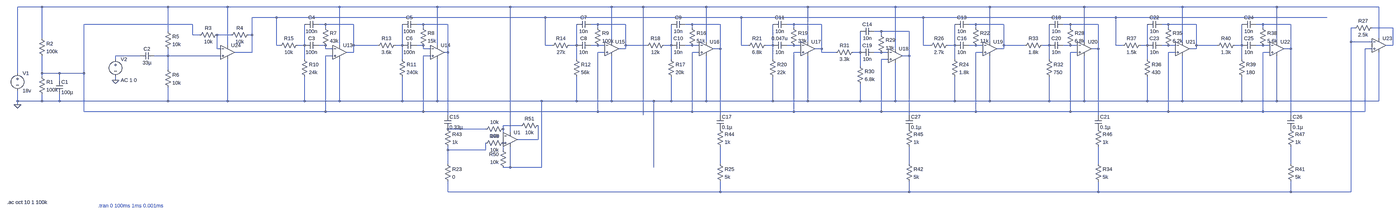
[diagram p0: schematic Final_Advanced_Equilizer.asc, whole sheet]
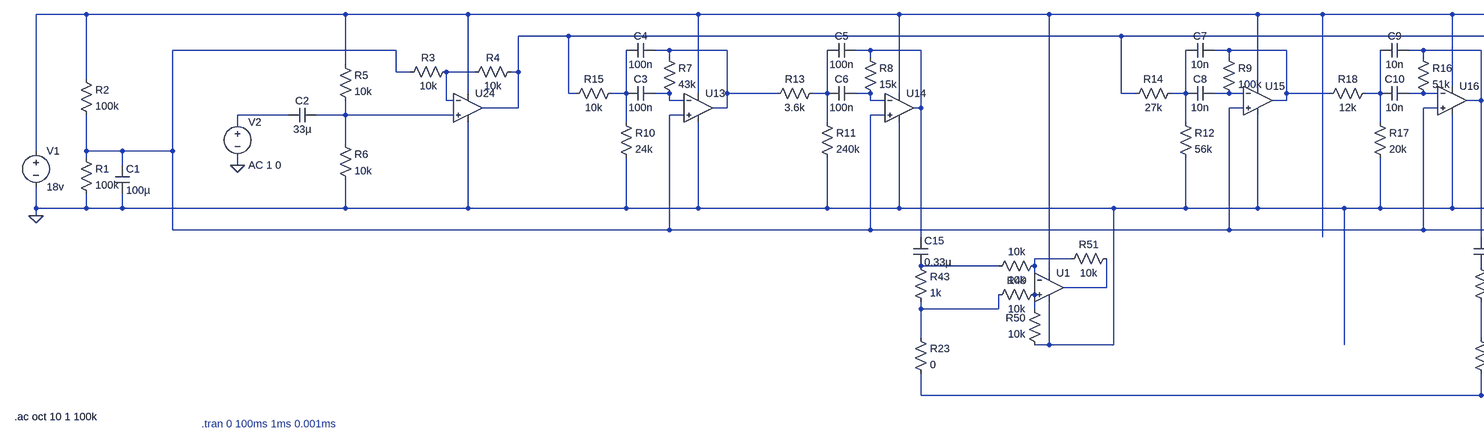
[diagram p1: schematic Final_Advanced_Equilizer.asc, part, row 1 of 1, column 1 of 2]
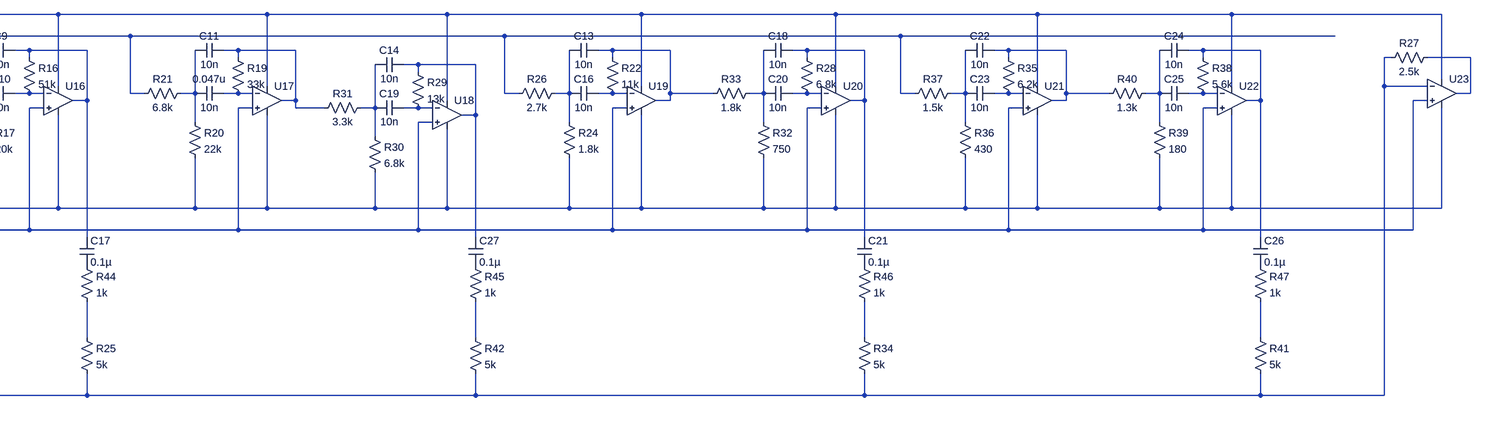
[diagram p2: schematic Final_Advanced_Equilizer.asc, part, row 1 of 1, column 2 of 2]
Final_Advanced_Equilizer.asc, the LTspice schematic file:
Version 4
SHEET 1 5168 1268
WIRE -1328 -176 -1440 -176
WIRE -752 -176 -1328 -176
WIRE -480 -176 -752 -176
WIRE 32 -176 -480 -176
WIRE 512 -176 32 -176
WIRE 880 -176 512 -176
WIRE 1344 -176 880 -176
WIRE 1488 -176 1344 -176
WIRE 1776 -176 1488 -176
WIRE 2240 -176 1776 -176
WIRE 2640 -176 2240 -176
WIRE 3072 -176 2640 -176
WIRE 3504 -176 3072 -176
WIRE 3952 -176 3504 -176
WIRE 4384 -176 3952 -176
WIRE 4944 -176 4384 -176
WIRE -256 -128 -368 -128
WIRE 1040 -128 -256 -128
WIRE 1936 -128 1040 -128
WIRE 2768 -128 1936 -128
WIRE 3648 -128 2768 -128
WIRE 4704 -128 3648 -128
WIRE -640 -96 -1136 -96
WIRE -32 -96 -64 -96
WIRE 96 -96 -32 -96
WIRE 448 -96 416 -96
WIRE 560 -96 448 -96
WIRE 1280 -96 1248 -96
WIRE 1408 -96 1280 -96
WIRE 1712 -96 1680 -96
WIRE 1840 -96 1712 -96
WIRE 2176 -96 2144 -96
WIRE 2304 -96 2176 -96
WIRE 3008 -96 2976 -96
WIRE 3136 -96 3008 -96
WIRE 3440 -96 3408 -96
WIRE 3568 -96 3440 -96
WIRE 3888 -96 3856 -96
WIRE 4016 -96 3888 -96
WIRE 4320 -96 4288 -96
WIRE 4448 -96 4320 -96
WIRE -32 -80 -32 -96
WIRE 448 -80 448 -96
WIRE 1280 -80 1280 -96
WIRE 1712 -80 1712 -96
WIRE 2176 -80 2176 -96
WIRE 3008 -80 3008 -96
WIRE 3440 -80 3440 -96
WIRE 3888 -80 3888 -96
WIRE 4320 -80 4320 -96
WIRE 4832 -80 4816 -80
WIRE 5008 -80 4912 -80
WIRE -752 -64 -752 -176
WIRE 2576 -64 2544 -64
WIRE 2704 -64 2576 -64
WIRE -640 -48 -640 -96
WIRE -608 -48 -640 -48
WIRE -464 -48 -528 -48
WIRE -368 -48 -368 -128
WIRE -368 -48 -384 -48
WIRE 2576 -48 2576 -64
WIRE -1328 -32 -1328 -176
WIRE 4944 -32 4944 -176
WIRE 1344 -16 1344 -176
WIRE 1776 -16 1776 -176
WIRE 2240 -16 2240 -176
WIRE 3072 -16 3072 -176
WIRE 3504 -16 3504 -176
WIRE 3952 -16 3952 -176
WIRE 4384 -16 4384 -176
WIRE 4816 -16 4816 -80
WIRE 4912 -16 4816 -16
WIRE -480 0 -480 -176
WIRE -256 0 -256 -128
WIRE -240 0 -256 0
WIRE -128 0 -128 -96
WIRE -128 0 -160 0
WIRE -32 0 -64 0
WIRE 32 0 32 -176
WIRE 96 0 96 -96
WIRE 240 0 96 0
WIRE 352 0 352 -96
WIRE 352 0 320 0
WIRE 448 0 416 0
WIRE 512 0 512 -176
WIRE 1040 0 1040 -128
WIRE 1072 0 1040 0
WIRE 1184 0 1184 -96
WIRE 1184 0 1152 0
WIRE 1280 0 1248 0
WIRE 1312 0 1280 0
WIRE 1408 0 1408 -96
WIRE 1504 0 1408 0
WIRE 1616 0 1616 -96
WIRE 1616 0 1584 0
WIRE 1712 0 1680 0
WIRE 1744 0 1712 0
WIRE 1936 0 1936 -128
WIRE 1968 0 1936 0
WIRE 2080 0 2080 -96
WIRE 2080 0 2048 0
WIRE 2176 0 2144 0
WIRE 2208 0 2176 0
WIRE 2768 0 2768 -128
WIRE 2800 0 2768 0
WIRE 2912 0 2912 -96
WIRE 2912 0 2880 0
WIRE 3008 0 2976 0
WIRE 3040 0 3008 0
WIRE 3136 0 3136 -96
WIRE 3232 0 3136 0
WIRE 3344 0 3344 -96
WIRE 3344 0 3312 0
WIRE 3440 0 3408 0
WIRE 3472 0 3440 0
WIRE 3648 0 3648 -128
WIRE 3680 0 3648 0
WIRE 3792 0 3792 -96
WIRE 3792 0 3760 0
WIRE 3888 0 3856 0
WIRE 3920 0 3888 0
WIRE 4016 0 4016 -96
WIRE 4112 0 4016 0
WIRE 4224 0 4224 -96
WIRE 4224 0 4192 0
WIRE 4320 0 4288 0
WIRE 4352 0 4320 0
WIRE 5008 0 5008 -80
WIRE 5008 0 4976 0
WIRE -528 16 -528 -48
WIRE -512 16 -528 16
WIRE -32 16 -32 0
WIRE 0 16 -32 16
WIRE 448 16 448 0
WIRE 480 16 448 16
WIRE 1408 16 1408 0
WIRE 1408 16 1376 16
WIRE 1840 16 1840 -96
WIRE 1840 16 1808 16
WIRE 2304 16 2304 -96
WIRE 2304 16 2272 16
WIRE 2640 16 2640 -176
WIRE 3136 16 3136 0
WIRE 3136 16 3104 16
WIRE 3568 16 3568 -96
WIRE 3568 16 3536 16
WIRE 4016 16 4016 0
WIRE 4016 16 3984 16
WIRE 4448 16 4448 -96
WIRE 4448 16 4416 16
WIRE 4912 16 4880 16
WIRE -368 32 -368 -48
WIRE -368 32 -448 32
WIRE 96 32 96 0
WIRE 96 32 64 32
WIRE 560 32 560 -96
WIRE 560 32 544 32
WIRE 1312 32 1280 32
WIRE 1744 32 1712 32
WIRE 2208 32 2176 32
WIRE 2304 32 2304 16
WIRE 2368 32 2304 32
WIRE 2480 32 2480 -64
WIRE 2480 32 2448 32
WIRE 2576 32 2544 32
WIRE 2608 32 2576 32
WIRE 3040 32 3008 32
WIRE 3472 32 3440 32
WIRE 3920 32 3888 32
WIRE 4352 32 4320 32
WIRE -880 48 -992 48
WIRE -752 48 -752 16
WIRE -752 48 -816 48
WIRE -512 48 -752 48
WIRE 0 48 -32 48
WIRE 480 48 448 48
WIRE 2704 48 2704 -64
WIRE 2704 48 2672 48
WIRE -992 64 -992 48
WIRE -128 64 -128 0
WIRE 352 64 352 0
WIRE 1184 64 1184 0
WIRE 1616 64 1616 0
WIRE 2080 64 2080 0
WIRE 2608 64 2576 64
WIRE 2912 64 2912 0
WIRE 3344 64 3344 0
WIRE 3792 64 3792 0
WIRE 4224 64 4224 0
WIRE 2480 96 2480 32
WIRE -752 112 -752 48
WIRE -1440 128 -1440 -176
WIRE -1328 128 -1328 48
WIRE -1248 128 -1328 128
WIRE -1136 128 -1136 -96
WIRE -1136 128 -1248 128
WIRE -1328 144 -1328 128
WIRE -1248 160 -1248 128
WIRE -992 160 -992 144
WIRE -1440 256 -1440 208
WIRE -1328 256 -1328 224
WIRE -1328 256 -1440 256
WIRE -1248 256 -1248 224
WIRE -1248 256 -1328 256
WIRE -752 256 -752 192
WIRE -752 256 -1248 256
WIRE -480 256 -480 64
WIRE -480 256 -752 256
WIRE -128 256 -128 144
WIRE -128 256 -480 256
WIRE 32 256 32 64
WIRE 32 256 -128 256
WIRE 352 256 352 144
WIRE 352 256 32 256
WIRE 512 256 512 64
WIRE 512 256 352 256
WIRE 1024 256 512 256
WIRE 1184 256 1184 144
WIRE 1184 256 1024 256
WIRE 1344 256 1344 48
WIRE 1344 256 1184 256
WIRE 1536 256 1344 256
WIRE 1616 256 1616 144
WIRE 1616 256 1536 256
WIRE 1776 256 1776 48
WIRE 1776 256 1616 256
WIRE 2080 256 2080 144
WIRE 2080 256 1776 256
WIRE 2240 256 2240 48
WIRE 2240 256 2080 256
WIRE 2480 256 2480 176
WIRE 2480 256 2240 256
WIRE 2640 256 2640 80
WIRE 2640 256 2480 256
WIRE 2912 256 2912 144
WIRE 2912 256 2640 256
WIRE 3072 256 3072 48
WIRE 3072 256 2912 256
WIRE 3344 256 3344 144
WIRE 3344 256 3072 256
WIRE 3504 256 3504 48
WIRE 3504 256 3344 256
WIRE 3792 256 3792 144
WIRE 3792 256 3504 256
WIRE 3952 256 3952 48
WIRE 3952 256 3792 256
WIRE 4224 256 4224 144
WIRE 4224 256 3952 256
WIRE 4384 256 4384 48
WIRE 4384 256 4224 256
WIRE 4944 256 4944 32
WIRE 4944 256 4384 256
WIRE -1440 272 -1440 256
WIRE -1136 304 -1136 128
WIRE -32 304 -32 48
WIRE -32 304 -1136 304
WIRE 448 304 448 48
WIRE 448 304 -32 304
WIRE 1280 304 1280 32
WIRE 1280 304 448 304
WIRE 1712 304 1712 32
WIRE 1712 304 1280 304
WIRE 2176 304 2176 32
WIRE 2176 304 1712 304
WIRE 2576 304 2576 64
WIRE 2576 304 2176 304
WIRE 3008 304 3008 32
WIRE 3008 304 2576 304
WIRE 3440 304 3440 32
WIRE 3440 304 3008 304
WIRE 3888 304 3888 32
WIRE 3888 304 3440 304
WIRE 4320 304 4320 32
WIRE 4320 304 3888 304
WIRE 4880 304 4880 16
WIRE 4880 304 4320 304
WIRE 560 320 560 32
WIRE 1488 320 1488 -176
WIRE 1840 320 1840 16
WIRE 2704 320 2704 48
WIRE 3568 320 3568 16
WIRE 4448 320 4448 16
WIRE 928 368 848 368
WIRE 768 384 560 384
WIRE 848 384 848 368
WIRE 880 400 880 -176
WIRE 848 416 848 384
WIRE 1008 432 1008 368
WIRE 1008 432 912 432
WIRE 560 480 560 464
WIRE 768 480 768 448
WIRE 768 480 560 480
WIRE 848 480 848 448
WIRE 560 544 560 480
WIRE 1840 544 1840 464
WIRE 2704 544 2704 464
WIRE 3568 544 3568 464
WIRE 4448 544 4448 464
WIRE 880 560 880 464
WIRE 880 560 848 560
WIRE 1024 560 1024 256
WIRE 1024 560 880 560
WIRE 1536 560 1536 256
WIRE 560 672 560 624
WIRE 1840 672 1840 624
WIRE 1840 672 560 672
WIRE 2704 672 2704 624
WIRE 2704 672 1840 672
WIRE 3568 672 3568 624
WIRE 3568 672 2704 672
WIRE 4448 672 4448 624
WIRE 4448 672 3568 672
WIRE 4816 672 4816 -16
WIRE 4816 672 4448 672
FLAG -1440 272 0
FLAG -992 160 0
DATAFLAG 560 320 "$-V(N005)"
DATAFLAG 2704 144 ""
DATAFLAG 2176 208 ""
SYMBOL voltage -1440 112 R0
WINDOW 123 0 0 Left 0
WINDOW 39 0 0 Left 0
SYMATTR InstName V1
SYMATTR Value 18v
SYMBOL res -1344 128 R0
SYMATTR InstName R1
SYMATTR Value 100k
SYMBOL res -1344 -48 R0
SYMATTR InstName R2
SYMATTR Value 100k
SYMBOL cap -1264 160 R0
SYMATTR InstName C1
SYMATTR Value 100µ
SYMBOL res -512 -64 R90
WINDOW 0 0 56 VBottom 2
WINDOW 3 32 56 VTop 2
SYMATTR InstName R3
SYMATTR Value 10k
SYMBOL res -368 -64 R90
WINDOW 0 0 56 VBottom 2
WINDOW 3 32 56 VTop 2
SYMATTR InstName R4
SYMATTR Value 10k
SYMBOL res -768 -80 R0
SYMATTR InstName R5
SYMATTR Value 10k
SYMBOL res -768 96 R0
SYMATTR InstName R6
SYMATTR Value 10k
SYMBOL cap -816 32 R90
WINDOW 0 0 32 VBottom 2
WINDOW 3 32 32 VTop 2
SYMATTR InstName C2
SYMATTR Value 33µ
SYMBOL voltage -992 48 R0
WINDOW 123 24 112 Left 2
WINDOW 39 0 0 Left 0
SYMATTR Value2 AC 1 0
SYMATTR InstName V2
SYMATTR Value ""
SYMBOL res -48 -96 R0
SYMATTR InstName R7
SYMATTR Value 43k
SYMBOL res 432 -96 R0
SYMATTR InstName R8
SYMATTR Value 15k
SYMBOL res 1264 -96 R0
SYMATTR InstName R9
SYMATTR Value 100k
SYMBOL cap -64 -16 R90
WINDOW 0 0 32 VBottom 2
WINDOW 3 32 32 VTop 2
SYMATTR InstName C3
SYMATTR Value 100n
SYMBOL cap -64 -112 R90
WINDOW 0 0 32 VBottom 2
WINDOW 3 32 32 VTop 2
SYMATTR InstName C4
SYMATTR Value 100n
SYMBOL cap 416 -112 R90
WINDOW 0 0 32 VBottom 2
WINDOW 3 32 32 VTop 2
SYMATTR InstName C5
SYMATTR Value 100n
SYMBOL cap 416 -16 R90
WINDOW 0 0 32 VBottom 2
WINDOW 3 32 32 VTop 2
SYMATTR InstName C6
SYMATTR Value 100n
SYMBOL cap 1248 -112 R90
WINDOW 0 0 32 VBottom 2
WINDOW 3 32 32 VTop 2
SYMATTR InstName C7
SYMATTR Value 10n
SYMBOL cap 1248 -16 R90
WINDOW 0 0 32 VBottom 2
WINDOW 3 32 32 VTop 2
SYMATTR InstName C8
SYMATTR Value 10n
SYMBOL res -144 48 R0
SYMATTR InstName R10
SYMATTR Value 24k
SYMBOL res 336 48 R0
SYMATTR InstName R11
SYMATTR Value 240k
SYMBOL res 1168 48 R0
SYMATTR InstName R12
SYMATTR Value 56k
SYMBOL res 336 -16 R90
WINDOW 0 0 56 VBottom 2
WINDOW 3 32 56 VTop 2
SYMATTR InstName R13
SYMATTR Value 3.6k
SYMBOL res 1168 -16 R90
WINDOW 0 0 56 VBottom 2
WINDOW 3 32 56 VTop 2
SYMATTR InstName R14
SYMATTR Value 27k
SYMBOL res -144 -16 R90
WINDOW 0 0 56 VBottom 2
WINDOW 3 32 56 VTop 2
SYMATTR InstName R15
SYMATTR Value 10k
SYMBOL res 1696 -96 R0
SYMATTR InstName R16
SYMATTR Value 51k
SYMBOL cap 1680 -112 R90
WINDOW 0 0 32 VBottom 2
WINDOW 3 32 32 VTop 2
SYMATTR InstName C9
SYMATTR Value 10n
SYMBOL cap 1680 -16 R90
WINDOW 0 0 32 VBottom 2
WINDOW 3 32 32 VTop 2
SYMATTR InstName C10
SYMATTR Value 10n
SYMBOL res 1600 48 R0
SYMATTR InstName R17
SYMATTR Value 20k
SYMBOL res 1600 -16 R90
WINDOW 0 0 56 VBottom 2
WINDOW 3 32 56 VTop 2
SYMATTR InstName R18
SYMATTR Value 12k
SYMBOL res 2160 -96 R0
SYMATTR InstName R19
SYMATTR Value 33k
SYMBOL cap 2144 -112 R90
WINDOW 0 0 32 VBottom 2
WINDOW 3 32 32 VTop 2
SYMATTR InstName C11
SYMATTR Value 10n
SYMBOL cap 2144 -16 R90
WINDOW 0 0 32 VBottom 2
WINDOW 3 32 32 VTop 2
SYMATTR InstName 0.047u
SYMATTR Value 10n
SYMBOL res 2064 48 R0
SYMATTR InstName R20
SYMATTR Value 22k
SYMBOL res 2064 -16 R90
WINDOW 0 0 56 VBottom 2
WINDOW 3 32 56 VTop 2
SYMATTR InstName R21
SYMATTR Value 6.8k
SYMBOL cap 544 320 R0
SYMATTR InstName C15
SYMATTR Value 0.33µ
SYMBOL cap 1824 320 R0
SYMATTR InstName C17
SYMATTR Value 0.1µ
SYMBOL res 544 528 R0
SYMATTR InstName R23
SYMATTR Value 0
SYMBOL res 1824 528 R0
SYMATTR InstName R25
SYMATTR Value 5k
SYMBOL res 4928 -96 R90
WINDOW 0 0 56 VBottom 2
WINDOW 3 32 56 VTop 2
SYMATTR InstName R27
SYMATTR Value 2.5k
SYMBOL res 2560 -64 R0
SYMATTR InstName R29
SYMATTR Value 13k
SYMBOL cap 2544 -80 R90
WINDOW 0 0 32 VBottom 2
WINDOW 3 32 32 VTop 2
SYMATTR InstName C14
SYMATTR Value 10n
SYMBOL cap 2544 16 R90
WINDOW 0 0 32 VBottom 2
WINDOW 3 32 32 VTop 2
SYMATTR InstName C19
SYMATTR Value 10n
SYMBOL res 2464 80 R0
SYMATTR InstName R30
SYMATTR Value 6.8k
SYMBOL res 2464 16 R90
WINDOW 0 0 56 VBottom 2
WINDOW 3 32 56 VTop 2
SYMATTR InstName R31
SYMATTR Value 3.3k
SYMBOL res 2992 -96 R0
SYMATTR InstName R22
SYMATTR Value 11k
SYMBOL cap 2976 -112 R90
WINDOW 0 0 32 VBottom 2
WINDOW 3 32 32 VTop 2
SYMATTR InstName C13
SYMATTR Value 10n
SYMBOL cap 2976 -16 R90
WINDOW 0 0 32 VBottom 2
WINDOW 3 32 32 VTop 2
SYMATTR InstName C16
SYMATTR Value 10n
SYMBOL res 2896 48 R0
SYMATTR InstName R24
SYMATTR Value 1.8k
SYMBOL res 2896 -16 R90
WINDOW 0 0 56 VBottom 2
WINDOW 3 32 56 VTop 2
SYMATTR InstName R26
SYMATTR Value 2.7k
SYMBOL res 3424 -96 R0
SYMATTR InstName R28
SYMATTR Value 6.8k
SYMBOL cap 3408 -112 R90
WINDOW 0 0 32 VBottom 2
WINDOW 3 32 32 VTop 2
SYMATTR InstName C18
SYMATTR Value 10n
SYMBOL cap 3408 -16 R90
WINDOW 0 0 32 VBottom 2
WINDOW 3 32 32 VTop 2
SYMATTR InstName C20
SYMATTR Value 10n
SYMBOL res 3328 48 R0
SYMATTR InstName R32
SYMATTR Value 750
SYMBOL res 3328 -16 R90
WINDOW 0 0 56 VBottom 2
WINDOW 3 32 56 VTop 2
SYMATTR InstName R33
SYMATTR Value 1.8k
SYMBOL cap 3552 320 R0
SYMATTR InstName C21
SYMATTR Value 0.1µ
SYMBOL res 3552 528 R0
SYMATTR InstName R34
SYMATTR Value 5k
SYMBOL res 3872 -96 R0
SYMATTR InstName R35
SYMATTR Value 6.2k
SYMBOL cap 3856 -112 R90
WINDOW 0 0 32 VBottom 2
WINDOW 3 32 32 VTop 2
SYMATTR InstName C22
SYMATTR Value 10n
SYMBOL cap 3856 -16 R90
WINDOW 0 0 32 VBottom 2
WINDOW 3 32 32 VTop 2
SYMATTR InstName C23
SYMATTR Value 10n
SYMBOL res 3776 48 R0
SYMATTR InstName R36
SYMATTR Value 430
SYMBOL res 3776 -16 R90
WINDOW 0 0 56 VBottom 2
WINDOW 3 32 56 VTop 2
SYMATTR InstName R37
SYMATTR Value 1.5k
SYMBOL res 4304 -96 R0
SYMATTR InstName R38
SYMATTR Value 5.6k
SYMBOL cap 4288 -112 R90
WINDOW 0 0 32 VBottom 2
WINDOW 3 32 32 VTop 2
SYMATTR InstName C24
SYMATTR Value 10n
SYMBOL cap 4288 -16 R90
WINDOW 0 0 32 VBottom 2
WINDOW 3 32 32 VTop 2
SYMATTR InstName C25
SYMATTR Value 10n
SYMBOL res 4208 48 R0
SYMATTR InstName R39
SYMATTR Value 180
SYMBOL res 4208 -16 R90
WINDOW 0 0 56 VBottom 2
WINDOW 3 32 56 VTop 2
SYMATTR InstName R40
SYMATTR Value 1.3k
SYMBOL cap 4432 320 R0
SYMATTR InstName C26
SYMATTR Value 0.1µ
SYMBOL res 4432 528 R0
SYMATTR InstName R41
SYMATTR Value 5k
SYMBOL cap 2688 320 R0
SYMATTR InstName C27
SYMATTR Value 0.1µ
SYMBOL res 2688 528 R0
SYMATTR InstName R42
SYMATTR Value 5k
SYMBOL OpAmps\\UniversalOpAmp 32 32 R0
SYMATTR InstName U13
SYMBOL OpAmps\\UniversalOpAmp 512 32 R0
SYMATTR InstName U14
SYMBOL OpAmps\\UniversalOpAmp 1344 16 R0
SYMATTR InstName U15
SYMBOL OpAmps\\UniversalOpAmp 1776 16 R0
SYMATTR InstName U16
SYMBOL OpAmps\\UniversalOpAmp 2240 16 R0
SYMATTR InstName U17
SYMBOL OpAmps\\UniversalOpAmp 2640 48 R0
SYMATTR InstName U18
SYMBOL OpAmps\\UniversalOpAmp 3072 16 R0
SYMATTR InstName U19
SYMBOL OpAmps\\UniversalOpAmp 3504 16 R0
SYMATTR InstName U20
SYMBOL OpAmps\\UniversalOpAmp 3952 16 R0
SYMATTR InstName U21
SYMBOL OpAmps\\UniversalOpAmp 4384 16 R0
SYMATTR InstName U22
SYMBOL OpAmps\\UniversalOpAmp 4944 0 R0
SYMATTR InstName U23
SYMBOL OpAmps\\UniversalOpAmp -480 32 R0
SYMATTR InstName U24
SYMBOL res 544 368 R0
SYMATTR InstName R43
SYMATTR Value 1k
SYMBOL res 1824 368 R0
SYMATTR InstName R44
SYMATTR Value 1k
SYMBOL res 2688 368 R0
SYMATTR InstName R45
SYMATTR Value 1k
SYMBOL res 3552 368 R0
SYMATTR InstName R46
SYMATTR Value 1k
SYMBOL res 4432 368 R0
SYMATTR InstName R47
SYMATTR Value 1k
SYMBOL OpAmps\\UniversalOpAmp 880 432 R0
SYMATTR InstName U1
SYMBOL res 864 368 R90
WINDOW 0 0 56 VBottom 2
WINDOW 3 32 56 VTop 2
SYMATTR InstName 10k
SYMATTR Value 10k
SYMBOL res 864 432 R90
WINDOW 0 0 56 VBottom 2
WINDOW 3 32 56 VTop 2
SYMATTR InstName R49
SYMATTR Value 10k
SYMBOL res 864 576 R180
WINDOW 0 36 76 Left 2
WINDOW 3 36 40 Left 2
SYMATTR InstName R50
SYMATTR Value 10k
SYMBOL res 912 384 R270
WINDOW 0 32 56 VTop 2
WINDOW 3 0 56 VBottom 2
SYMATTR InstName R51
SYMATTR Value 10k
TEXT -1488 720 Left 2 !.ac oct 10 1 100k
TEXT -1072 736 Left 2 ;.tran 0 100ms 1ms 0.001ms

The netlist it stands for:
* Final_Advanced_Equilizer.asc
V1 N001 0 18v
R1 N003 0 100k
R2 N001 N003 100k
C1 N003 0 100µ
R3 N016 N003 10k
R4 N002 N016 10k
R5 N001 N038 10k
R6 N038 0 10k
C2 N038 N037 33µ
V2 N037 0 AC 1 0
R7 N004 N018 43k
R8 N005 N020 15k
R9 N006 N022 100k
C3 N018 N017 100n
C4 N004 N017 100n
C5 N005 N019 100n
C6 N020 N019 100n
C7 N006 N021 10n
C8 N022 N021 10n
R10 N017 0 24k
R11 N019 0 240k
R12 N021 0 56k
R13 N019 N004 3.6k
R14 N021 N002 27k
R15 N017 N002 10k
R16 N007 N024 51k
C9 N007 N023 10n
C10 N024 N023 10n
R17 N023 0 20k
R18 N023 N006 12k
R19 N008 N026 33k
C11 N008 N025 10n
C§0.047u N026 N025 10n
R20 N025 0 22k
R21 N025 N002 6.8k
C15 N005 N040 0.33µ
C17 N007 P001 0.1µ
R23 N042 N013 0
R25 N044 N013 5k
R27 N014 N013 2.5k
R29 N015 N036 13k
C14 N015 N035 10n
C19 N036 N035 10n
R30 N035 0 6.8k
R31 N035 N008 3.3k
R22 N009 N028 11k
C13 N009 N027 10n
C16 N028 N027 10n
R24 N027 0 1.8k
R26 N027 N002 2.7k
R28 N010 N030 6.8k
C18 N010 N029 10n
C20 N030 N029 10n
R32 N029 0 750
R33 N029 N009 1.8k
C21 N010 P002 0.1µ
R34 N046 N013 5k
R35 N011 N032 6.2k
C22 N011 N031 10n
C23 N032 N031 10n
R36 N031 0 430
R37 N031 N002 1.5k
R38 N012 N034 5.6k
C24 N012 N033 10n
C25 N034 N033 10n
R39 N033 0 180
R40 N033 N011 1.3k
C26 N012 P003 0.1µ
R41 N047 N013 5k
C27 N015 P004 0.1µ
R42 N045 N013 5k
XU13 N003 N018 N001 0 N004 level1 Avol=1Meg GBW=10Meg Vos=0 En=0 Enk=0 In=0 Ink=0 Rin=500Meg  ; pins In+ In- V+ V- OUT
XU14 N003 N020 N001 0 N005 level1 Avol=1Meg GBW=10Meg Vos=0 En=0 Enk=0 In=0 Ink=0 Rin=500Meg  ; pins In+ In- V+ V- OUT
XU15 N003 N022 N001 0 N006 level1 Avol=1Meg GBW=10Meg Vos=0 En=0 Enk=0 In=0 Ink=0 Rin=500Meg  ; pins In+ In- V+ V- OUT
XU16 N003 N024 N001 0 N007 level1 Avol=1Meg GBW=10Meg Vos=0 En=0 Enk=0 In=0 Ink=0 Rin=500Meg  ; pins In+ In- V+ V- OUT
XU17 N003 N026 N001 0 N008 level1 Avol=1Meg GBW=10Meg Vos=0 En=0 Enk=0 In=0 Ink=0 Rin=500Meg  ; pins In+ In- V+ V- OUT
XU18 N003 N036 N001 0 N015 level1 Avol=1Meg GBW=10Meg Vos=0 En=0 Enk=0 In=0 Ink=0 Rin=500Meg  ; pins In+ In- V+ V- OUT
XU19 N003 N028 N001 0 N009 level1 Avol=1Meg GBW=10Meg Vos=0 En=0 Enk=0 In=0 Ink=0 Rin=500Meg  ; pins In+ In- V+ V- OUT
XU20 N003 N030 N001 0 N010 level1 Avol=1Meg GBW=10Meg Vos=0 En=0 Enk=0 In=0 Ink=0 Rin=500Meg  ; pins In+ In- V+ V- OUT
XU21 N003 N032 N001 0 N011 level1 Avol=1Meg GBW=10Meg Vos=0 En=0 Enk=0 In=0 Ink=0 Rin=500Meg  ; pins In+ In- V+ V- OUT
XU22 N003 N034 N001 0 N012 level1 Avol=1Meg GBW=10Meg Vos=0 En=0 Enk=0 In=0 Ink=0 Rin=500Meg  ; pins In+ In- V+ V- OUT
XU23 N003 N013 N001 0 N014 level1 Avol=1Meg GBW=10Meg Vos=0 En=0 Enk=0 In=0 Ink=0 Rin=500Meg  ; pins In+ In- V+ V- OUT
XU24 N038 N016 N001 0 N002 level1 Avol=1Meg GBW=10Meg Vos=0 En=0 Enk=0 In=0 Ink=0 Rin=500Meg  ; pins In+ In- V+ V- OUT
R43 N040 N042 1k
R44 P001 N044 1k
R45 P004 N045 1k
R46 P002 N046 1k
R47 P003 N047 1k
XU1 N043 N039 N001 0 N041 level1 Avol=1Meg GBW=10Meg Vos=0 En=0 Enk=0 In=0 Ink=0 Rin=500Meg  ; pins In+ In- V+ V- OUT
R§10k N039 N040 10k
R49 N043 N042 10k
R50 0 N043 10k
R51 N039 N041 10k
.ac oct 10 1 100k
* .tran 0 100ms 1ms 0.001ms
.lib UniversalOpAmp1.lib
.backanno
.end